# EasyEDA schematic SCH_course-project-oscilloscope_2025-03-16.json
TITLE: course-project-oscilloscope; REV: 1.0; Date: 2025-03-16; Sheet: 1/1; Drawn By: Валюк А 3-КСК-22
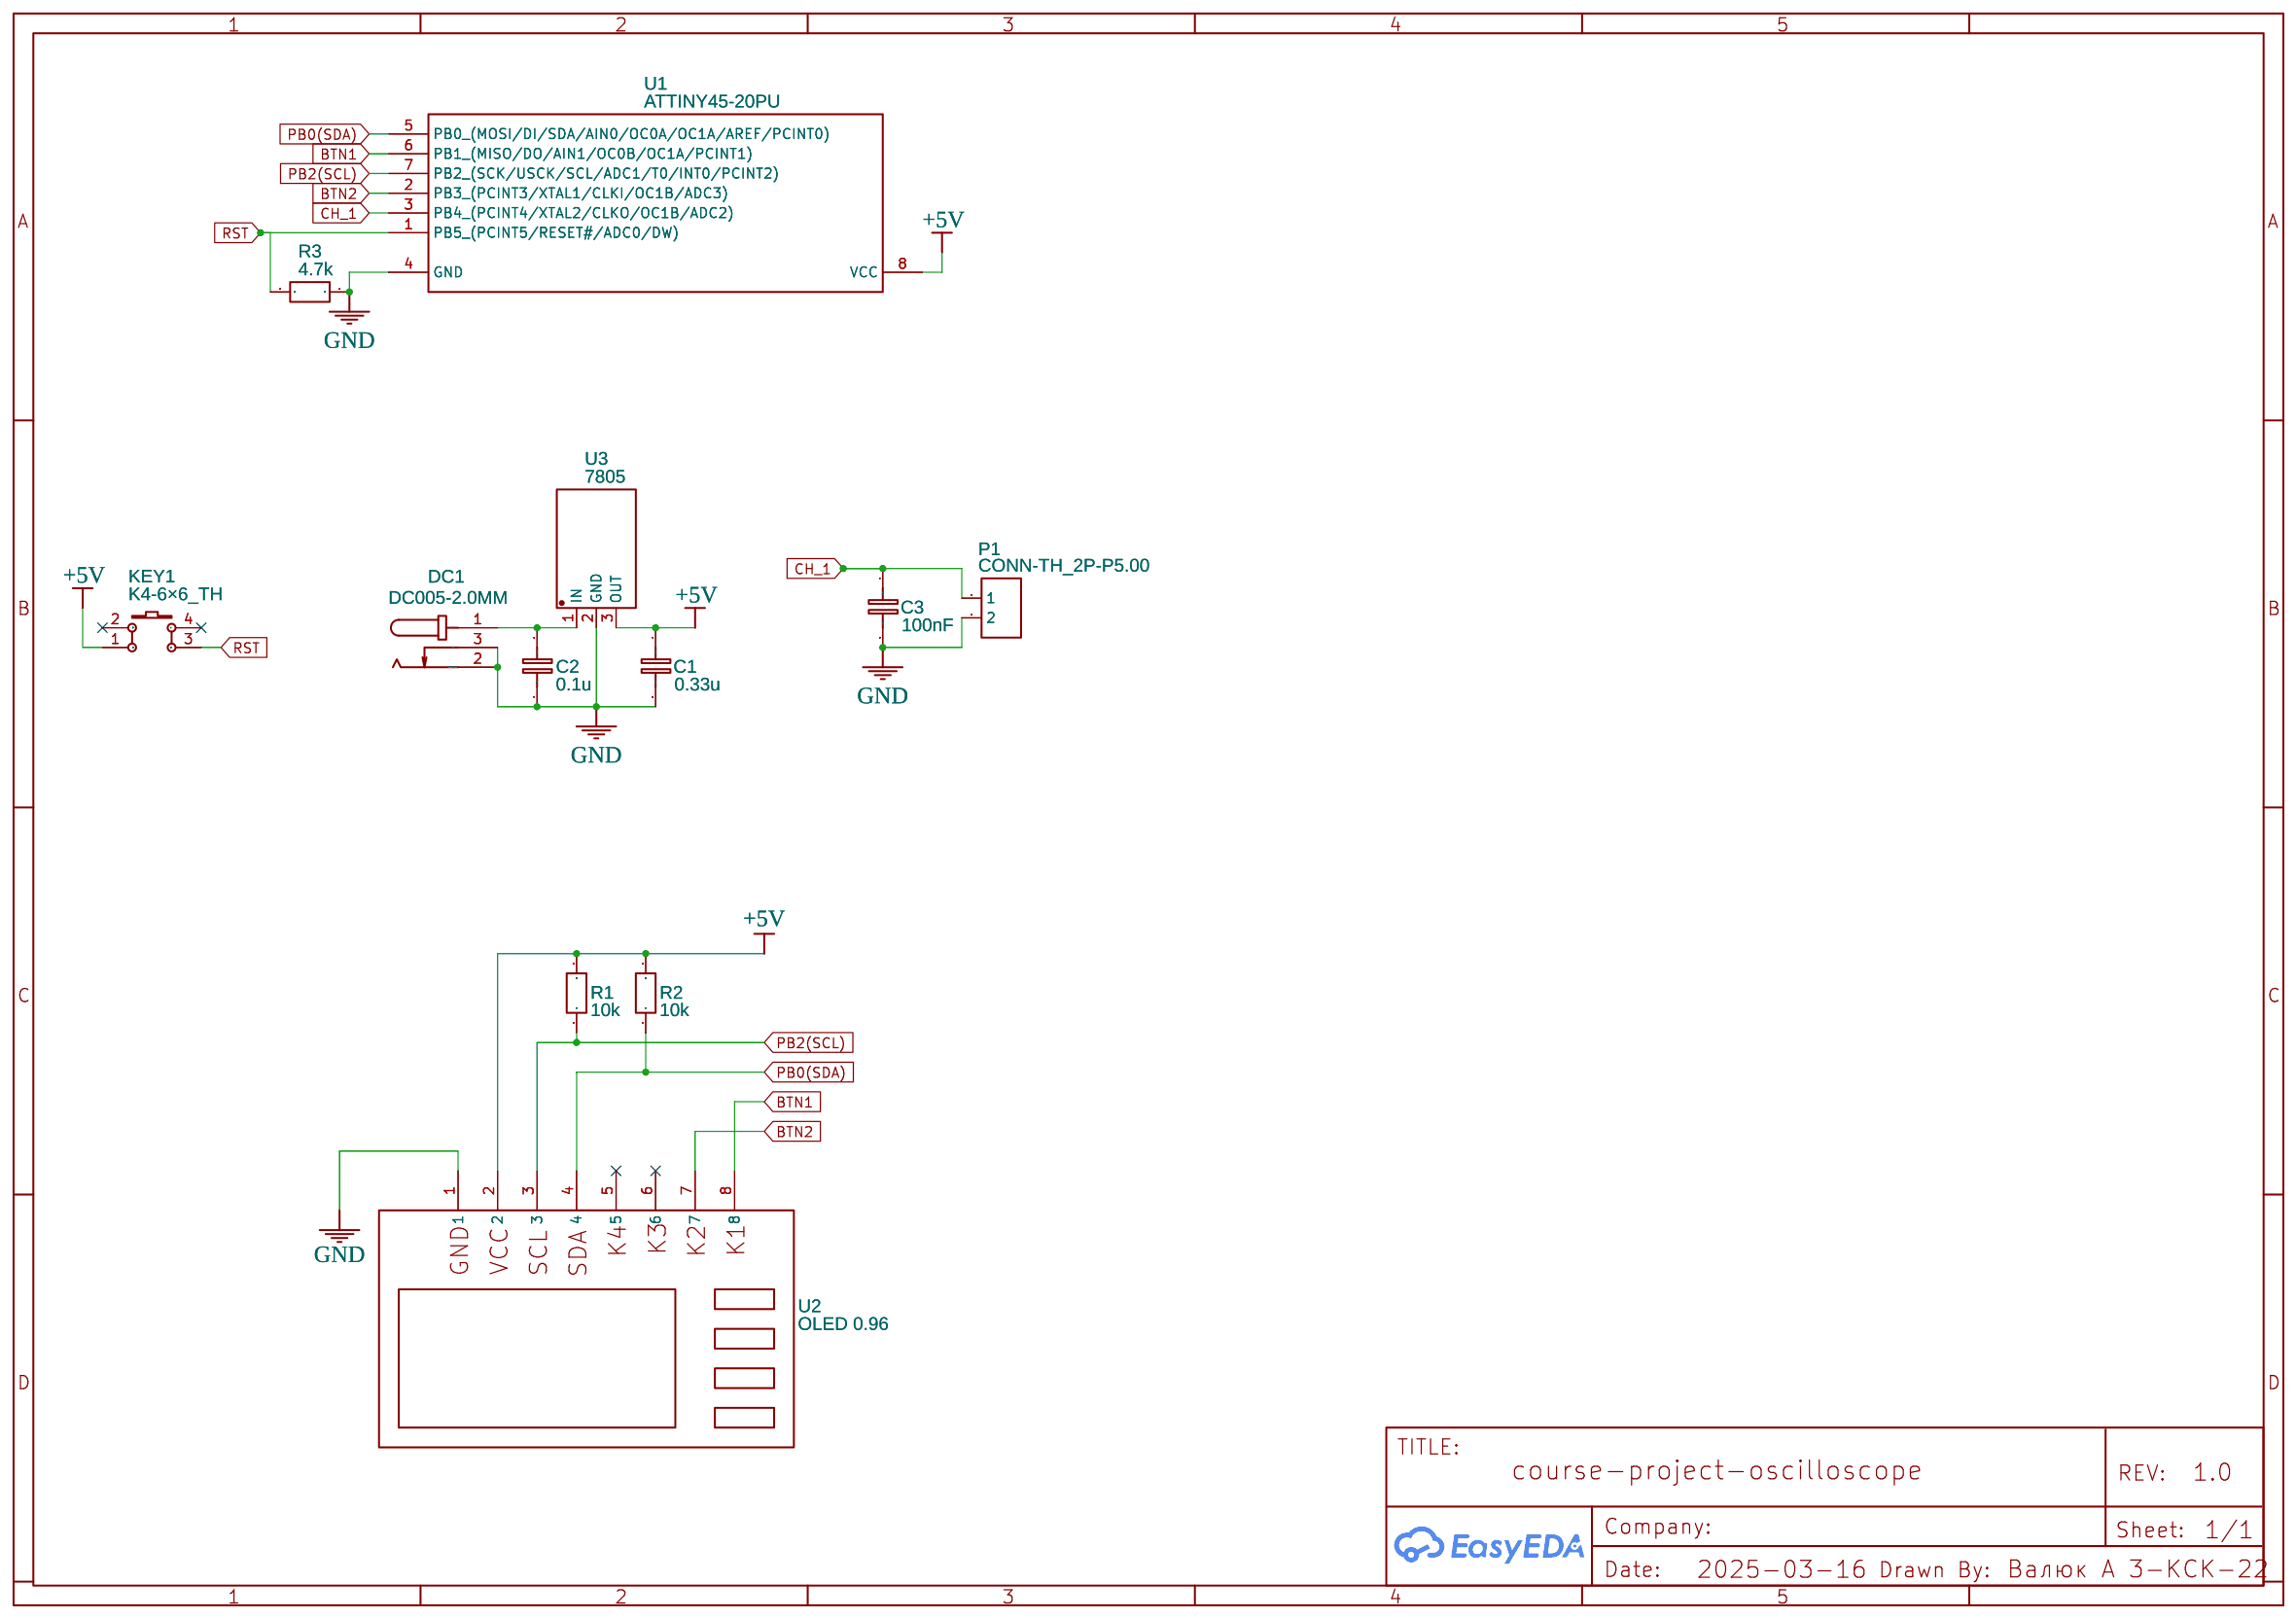
[diagram p0: schematic sheet]

## Parts
C1  0.33u  [RAD-0.1]
C2  0.1u  [RAD-0.1]
C3  100nF  [RAD-0.1]
DC1  DC005-2.0MM  [DC-IN-TH_DC005]
KEY1  K4-6×6_TH  [KEY-TH_4P-L6.0-W6.0-P4.50-LS6.5]
P1  CONN-TH_2P-P5.00  [CONN-TH_2P-P5.00]
R1  10k  [R_AXIAL-0.3]
R2  10k  [R_AXIAL-0.3]
R3  4.7k  [R_AXIAL-0.3]
U1  ATTINY45-20PU  [PDIP-8_L9.3-W6.4-P2.54-LS7.6-BL]
U2  OLED 0.96  [OLED]
U3  7805  [TO-220-3_L10.0-W4.5-P2.54-L]

## Library data of the parts
C1-C3 = C_RAD-0.1_EU: Contributor: LCEDA_Lib
DC1 = DC005-2.0MM: Supplier: LCSC; Manufacturer: SOFNG; Supplier Part: C111567
KEY1 = K4-6×6_TH: Supplier: LCSC; Supplier Part: C136684; Manufacturer: 韩国韩荣; Manufacturer Part: K2-1102DP-E4SW-04; Contributor: LCEDA_Lib
P1 = CONN-TH_2P-P5.00: Supplier: LCSC; Contributor: LCEDA_Lib
R1-R3 = R_AXIAL-0.3_EU: Contributor: LCEDA_Lib
U1 = ATTINY45-20PU: Contributor: LCSC; Supplier: LCSC; Manufacturer: MICROCHIP(美国微芯); Supplier Part: C152181; JLCPCB Part Class: Extended Part
U2 = OLED 0.96: Contributor: andrewalyuk
U3 = 7805: Contributor: LCSC; Supplier: LCSC; Supplier Part: C305416; Manufacturer: BLUE ROCKET(蓝箭); JLCPCB Part Class: Extended Part

## Nets
+5V: C1.1 KEY1.1 R1.2 R2.2 U1.8(VCC) U2.2 U3.3(OUT)
GND: C1.2 C2.2 C3.2 DC1.2 DC1.3 P1.2 R3.1 U1.4(GND) U2.1 U3.2(GND)
BTN1: U1.6(PB1 (MISO/DO/AIN1/OC0B/OC1A/PCINT1)) U2.8
BTN2: U1.2(PB3 (PCINT3/XTAL1/CLKI/OC1B/ADC3)) U2.7
CH_1: C3.1 P1.1 U1.3(PB4 (PCINT4/XTAL2/CLKO/OC1B/ADC2))
PB0(SDA): R2.1 U1.5(PB0 (MOSI/DI/SDA/AIN0/OC0A/OC1A/AREF/PCINT0)) U2.4
PB2(SCL): R1.1 U1.7(PB2 (SCK/USCK/SCL/ADC1/T0/INT0/PCINT2)) U2.3
RST: KEY1.3 R3.2 U1.1(PB5 (PCINT5/RESET#/ADC0/DW))
Net-(C2-1): C2.1 DC1.1 U3.1(IN)

Not connected (* = marked no-connect by the designer): KEY1 2* 4*; U2 5* 6*
